# Altium schematic sheet Hammer.SchDoc (part 2 of 2)
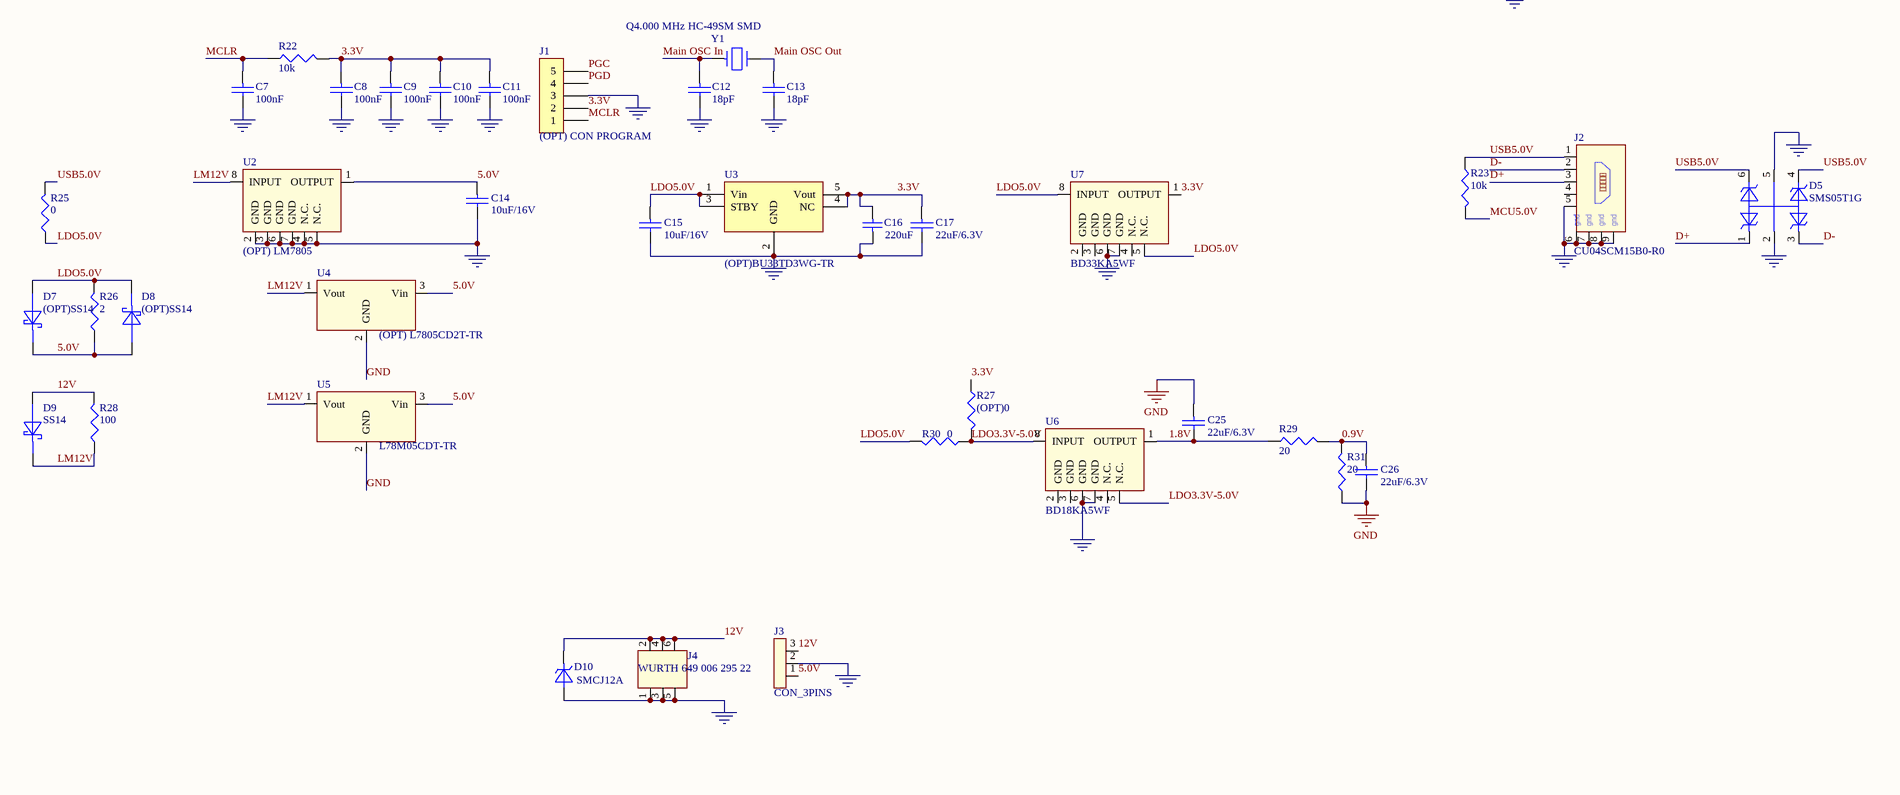
[diagram p6: Hammer.SchDoc, bottom right]

## Notes on the sheet
- (in symbol CON_USB_MINI_1) gnd

## Library data of the parts
C1 C1P_1-C1P_3 C2 C2P_1-C2P_3 C3 C3P_1-C3P_3 C4-C15 C17 C25 C26 = CAP: Capacitor
  C3 C5 C6: Manufacturer PN: *
C1_1-C1_16 C2_1-C2_16 C3_1-C3_16 C4_1-C4_16 C5_1-C5_16 C6_1-C6_16 C7_1-C7_16 C8_1-C8_16 C9_1-C9_16 C10_1-C10_16 C11_1-C11_16 C12_1-C12_16 C13_1-C13_16 C14_1-C14_16 C15_1-C15_16 C16_1-C16_16 = Cap Semi: Capacitor (Semiconductor SIM Model); Published: 8-Jun-2000; LatestRevisionDate: 29-May-2009; LatestRevisionNote: IPC-7351 Footprint Added.; PackageReference: C1206; Publisher: Altium Limited; PackageDescription: Chip Capacitor; Value: 470nF; Manufacturer PN: *
C4P_1-C4P_3 C5P_1-C5P_3 C6P_1-C6P_3 C7P_1-C7P_3 C8P_1-C8P_3 C16 C_220_1-C_220_71 C_220_73 = Cap Semi: CL32A227MQVNNNE 220UF 6.3V 20% X5R 1210; Published: 8-Jun-2000; LatestRevisionDate: 29-May-2009; LatestRevisionNote: IPC-7351 Footprint Added.; PackageReference: C1206; Publisher: Altium Limited; PackageDescription: Chip Capacitor
  C4P_1-C4P_3 C5P_1-C5P_3: Value: 100uF
  C6P_1-C6P_3 C7P_1-C7P_3 C8P_1-C8P_3 C16: Value: 220uF
  C_220_1-C_220_71 C_220_73: Value: (OPT)220uF
D1-D4 = LED_2: NOTE: <NOTE>
D1P_1-D1P_3 = D_DUAL_A1A2CC3: NOTE: <NOTE>
D5 = D_TVS_QUAD_C1AA2AA5C3C4C6: 4 IO lines TVS; NOTE: <NOTE>
D7-D9 = D_STKY: NOTE: <NOTE>
D10 = D_TVS_UNI: Еднопосочен трансил, 600W, UBRmin13.3V@1mA; NOTE: <NOTE>
J1 = CON5: Connector
J2 = CON_USB_MINI_1: NOTE: <NOTE>
J4 = CON_PCI-E: 4.20mm Male Dual Row Angled Header WR-MPC4
L1P_1-L1P_3 = L
Q1 = BJT_NPN_B1E2C3: NOTE: <NOTE>
Q1P_1-Q1P_3 Q2P_1-Q2P_3 Q3P_1-Q3P_3 = MOS_N_D1_S1S2S3G4D5D6D7D8: NOTE: <NOTE>
R1 R3-R23 R25-R31 = Res3: Resistor; Published: 8-Jun-2000; LatestRevisionDate: 29-May-2009; LatestRevisionNote: IPC-7351 Footprint Added.; PackageReference: J1-0603; Publisher: Altium Limited; PackageDescription: Chip Resistor
  R1 R3 R6 R7 R13: Value: 1k
  R4 R5 R8 R14: Value: 47
  R9-R12 R15 R20-R23: Value: 10k
  R16: Value: 2.4k
  R17 R25 R30: Value: 0
  R18: Value: 10k; Manufacturer PN: *
  R19: Value: (OPT)10k
  R26: Value: 2
  R27: Value: (OPT)0
  R28: Value: 100
  R29 R31: Value: 20
U1_1-U1_16 = HammerQ68: Hammer ASIC
U1P_1-U1P_3 = DRVFET_LTC4442: Mosfet 12V Dual Bootstrapped PWM Sync Buck Optimised
U2 U6 U7 = IC_LM2931AD-5.0R2G_SO-8
U3 = VOLTREG LDO
U4 U5 = IC_Vout1GND2Vin3: NOTE: <NOTE>
Y1 = CRYSTAL